# Altium schematic sheet [4]STM32F334R8T6Board_FilterAndOutputs.SchDoc
size B
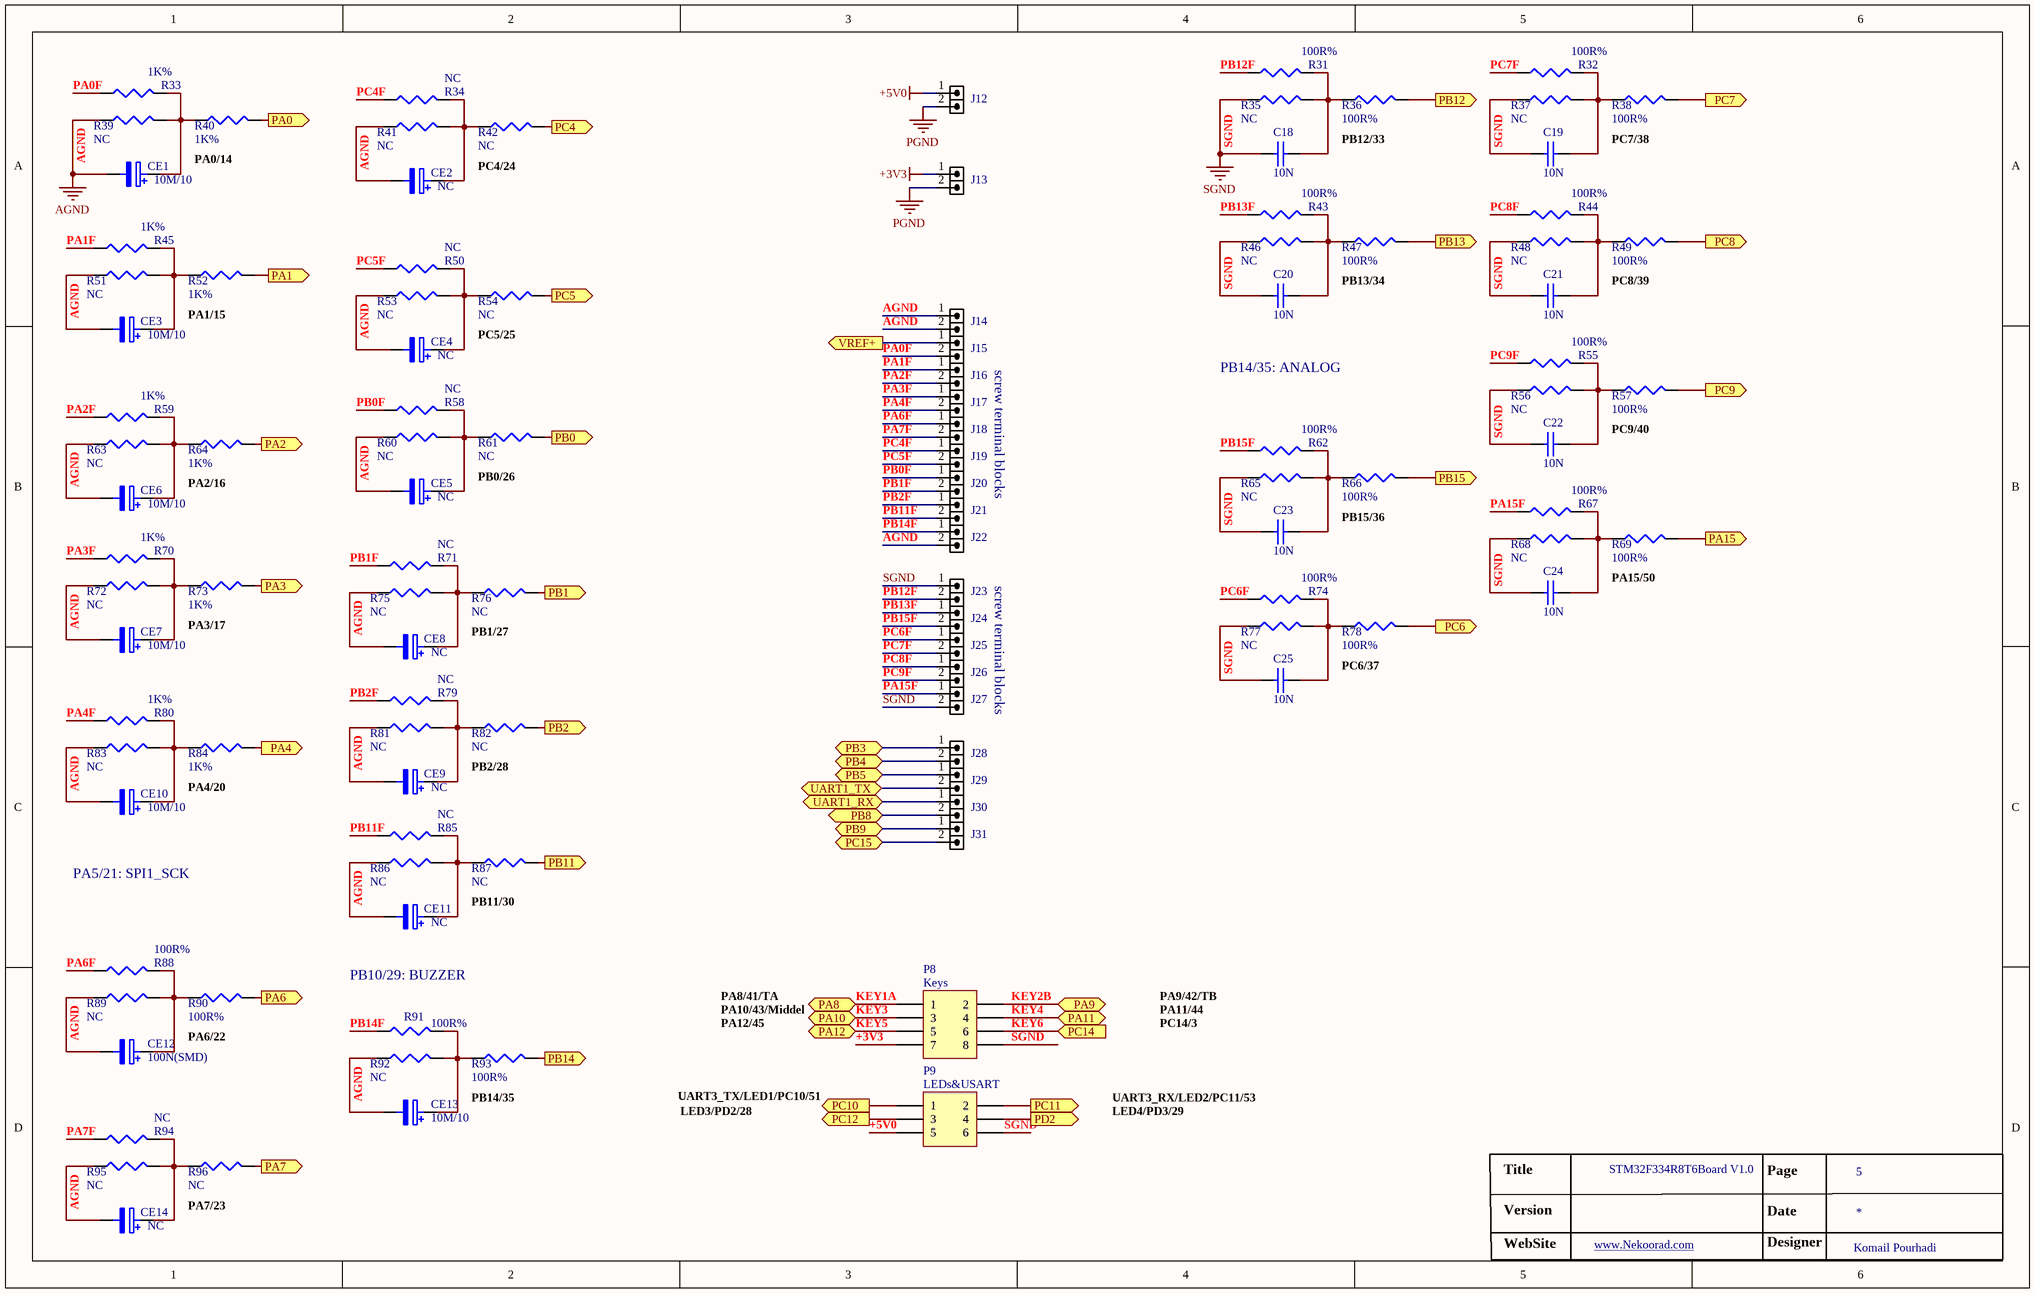
[diagram p0: [4]STM32F334R8T6Board_FilterAndOutputs.SchDoc]

## Parts
C18  10N  [SMD_CAP_1206]
C19  10N  [SMD_CAP_1206]
C20  10N  [SMD_CAP_1206]
C21  10N  [SMD_CAP_1206]
C22  10N  [SMD_CAP_1206]
C23  10N  [SMD_CAP_1206]
C24  10N  [SMD_CAP_1206]
C25  10N  [SMD_CAP_1206]
CE1  10M/10  [SMD_ECAP_D]
CE2  NC  [SMD_ECAP_D]
CE3  10M/10  [SMD_ECAP_D]
CE4  NC  [SMD_ECAP_D]
CE5  NC  [SMD_ECAP_D]
CE6  10M/10  [SMD_ECAP_D]
CE7  10M/10  [SMD_ECAP_D]
CE8  NC  [SMD_ECAP_D]
CE9  NC  [SMD_ECAP_D]
CE10  10M/10  [SMD_ECAP_D]
CE11  NC  [SMD_ECAP_D]
CE12  100N(SMD)  [SMD_ECAP_D]
CE13  10M/10  [SMD_ECAP_D]
CE14  NC  [SMD_ECAP_D]
J12  HDRM2  [header screw 2*1]  (value not drawn)
J13  HDRM2  [header screw 2*1]  (value not drawn)
J14  HDRM2  [header screw 2*1]  (value not drawn)
J15  HDRM2  [header screw 2*1]  (value not drawn)
J16  HDRM2  [header screw 2*1]  (value not drawn)
J17  HDRM2  [header screw 2*1]  (value not drawn)
J18  HDRM2  [header screw 2*1]  (value not drawn)
J19  HDRM2  [header screw 2*1]  (value not drawn)
J20  HDRM2  [header screw 2*1]  (value not drawn)
J21  HDRM2  [header screw 2*1]  (value not drawn)
J22  HDRM2  [header screw 2*1]  (value not drawn)
J23  HDRM2  [header screw 2*1]  (value not drawn)
J24  HDRM2  [header screw 2*1]  (value not drawn)
J25  HDRM2  [header screw 2*1]  (value not drawn)
J26  HDRM2  [header screw 2*1]  (value not drawn)
J27  HDRM2  [header screw 2*1]  (value not drawn)
J28  HDRM2  [header screw 2*1]  (value not drawn)
J29  HDRM2  [header screw 2*1]  (value not drawn)
J30  HDRM2  [header screw 2*1]  (value not drawn)
J31  HDRM2  [header screw 2*1]  (value not drawn)
P8  Keys  [IDC8-BOX]
P9  LEDs&USART  [IDC6-BOX]
R31  100R%  [RES_1206]
R32  100R%  [RES_1206]
R33  1K%  [RES_1206]
R34  NC  [RES_1206]
R35  NC  [RES_1206]
R36  100R%  [RES_1206]
R37  NC  [RES_1206]
R38  100R%  [RES_1206]
R39  NC  [RES_1206]
R40  1K%  [RES_1206]
R41  NC  [RES_1206]
R42  NC  [RES_1206]
R43  100R%  [RES_1206]
R44  100R%  [RES_1206]
R45  1K%  [RES_1206]
R46  NC  [RES_1206]
R47  100R%  [RES_1206]
R48  NC  [RES_1206]
R49  100R%  [RES_1206]
R50  NC  [RES_1206]
R51  NC  [RES_1206]
R52  1K%  [RES_1206]
R53  NC  [RES_1206]
R54  NC  [RES_1206]
R55  100R%  [RES_1206]
R56  NC  [RES_1206]
R57  100R%  [RES_1206]
R58  NC  [RES_1206]
R59  1K%  [RES_1206]
R60  NC  [RES_1206]
R61  NC  [RES_1206]
R62  100R%  [RES_1206]
R63  NC  [RES_1206]
R64  1K%  [RES_1206]
R65  NC  [RES_1206]
R66  100R%  [RES_1206]
R67  100R%  [RES_1206]
R68  NC  [RES_1206]
R69  100R%  [RES_1206]
R70  1K%  [RES_1206]
R71  NC  [RES_1206]
R72  NC  [RES_1206]
R73  1K%  [RES_1206]
R74  100R%  [RES_1206]
R75  NC  [RES_1206]
R76  NC  [RES_1206]
R77  NC  [RES_1206]
R78  100R%  [RES_1206]
R79  NC  [RES_1206]
R80  1K%  [RES_1206]
R81  NC  [RES_1206]
R82  NC  [RES_1206]
R83  NC  [RES_1206]
R84  1K%  [RES_1206]
R85  NC  [RES_1206]
R86  NC  [RES_1206]
R87  NC  [RES_1206]
R88  100R%  [RES_1206]
R89  NC  [RES_1206]
R90  100R%  [RES_1206]
R91  100R%  [RES_1206]
R92  NC  [RES_1206]
R93  100R%  [RES_1206]
R94  NC  [RES_1206]
R95  NC  [RES_1206]
R96  NC  [RES_1206]

## Ports
PA0 (out), PA1 (out), PA2 (out), PA3 (out), PA4 (out), PA6 (out), PA7 (out), PA8 (bidir), PA9 (bidir), PA10 (bidir), PA11 (bidir), PA12 (bidir), PA15 (out), PB0 (out), PB1 (out), PB2 (out), PB3 (bidir), PB4 (bidir), PB5 (bidir), PB8 (bidir), PB9 (bidir), PB11 (out), PB12 (out), PB13 (out), PB14 (out), PB15 (out), PC4 (out), PC5 (out), PC6 (out), PC7 (out), PC8 (out), PC9 (out), PC10 (out), PC11 (out), PC12 (out), PC14 (in), PC15 (bidir), PD2 (out), UART1_RX (bidir), UART1_TX (bidir), VREF+ (out)

## Nets
+3V3: J13.1 P8.7
+5V0: J12.1 P9.5
AGND: CE1.2 CE2.2 CE3.2 CE4.2 CE5.2 CE6.2 CE7.2 CE8.2 CE9.2 CE10.2 CE11.2 CE12.2 CE13.2 CE14.2 J14.1 J14.2 J22.2 R39.1 R41.1 R51.1 R53.1 R60.1 R63.1 R72.1 R75.1 R81.1 R83.1 R86.1 R89.1 R92.1 R95.1
PGND: J12.2 J13.2
SGND: C18.2 C19.2 C20.2 C21.2 C22.2 C23.2 C24.2 C25.2 J23.1 J27.2 P8.8 P9.6 R35.1 R37.1 R46.1 R48.1 R56.1 R65.1 R68.1 R77.1
KEY1A: P8.1 ; port PA8
KEY2B: P8.2 ; port PA9
KEY3: P8.3 ; port PA10
KEY4: P8.4 ; port PA11
KEY5: P8.5 ; port PA12
KEY6: P8.6 ; port PC14
PA0: R40.2 ; port PA0
PA0F: J15.2 R33.1
PA1: R52.2 ; port PA1
PA1F: J16.1 R45.1
PA2: R64.2 ; port PA2
PA2F: J16.2 R59.1
PA3: R73.2 ; port PA3
PA3F: J17.1 R70.1
PA4: R84.2 ; port PA4
PA4F: J17.2 R80.1
PA6: R90.2 ; port PA6
PA6F: J18.1 R88.1
PA7: R96.2 ; port PA7
PA7F: J18.2 R94.1
PA15: R69.2 ; port PA15
PA15F: J27.1 R67.1
PB0: R61.2 ; port PB0
PB0F: J20.1 R58.1
PB1: R76.2 ; port PB1
PB1F: J20.2 R71.1
PB2: R82.2 ; port PB2
PB2F: J21.1 R79.1
PB3: J28.1 ; port PB3
PB4: J28.2 ; port PB4
PB5: J29.1 ; port PB5
PB8: J30.2 ; port PB8
PB9: J31.1 ; port PB9
PB11: R87.2 ; port PB11
PB11F: J21.2 R85.1
PB12: R36.2 ; port PB12
PB12F: J23.2 R31.1
PB13: R47.2 ; port PB13
PB13F: J24.1 R43.1
PB14: R93.2 ; port PB14
PB14F: J22.1 R91.1
PB15: R66.2 ; port PB15
PB15F: J24.2 R62.1
PC4: R42.2 ; port PC4
PC4F: J19.1 R34.1
PC5: R54.2 ; port PC5
PC5F: J19.2 R50.1
PC6: R78.2 ; port PC6
PC6F: J25.1 R74.1
PC7: R38.2 ; port PC7
PC7F: J25.2 R32.1
PC8: R49.2 ; port PC8
PC8F: J26.1 R44.1
PC9: R57.2 ; port PC9
PC9F: J26.2 R55.1
PC10: P9.1 ; port PC10
PC11: P9.2 ; port PC11
PC12: P9.3 ; port PC12
PC15: J31.2 ; port PC15
PD2: P9.4 ; port PD2
UART1_RX: J30.1 ; port UART1_RX
VREF+: J15.1 ; port VREF+
NetC18_1: C18.1 R31.2 R35.2 R36.1
NetC19_1: C19.1 R32.2 R37.2 R38.1
NetC20_1: C20.1 R43.2 R46.2 R47.1
NetC21_1: C21.1 R44.2 R48.2 R49.1
NetC22_1: C22.1 R55.2 R56.2 R57.1
NetC23_1: C23.1 R62.2 R65.2 R66.1
NetC24_1: C24.1 R67.2 R68.2 R69.1
NetC25_1: C25.1 R74.2 R77.2 R78.1
NetCE1_1: CE1.1 R33.2 R39.2 R40.1
NetCE2_1: CE2.1 R34.2 R41.2 R42.1
NetCE3_1: CE3.1 R45.2 R51.2 R52.1
NetCE4_1: CE4.1 R50.2 R53.2 R54.1
NetCE5_1: CE5.1 R58.2 R60.2 R61.1
NetCE6_1: CE6.1 R59.2 R63.2 R64.1
NetCE7_1: CE7.1 R70.2 R72.2 R73.1
NetCE8_1: CE8.1 R71.2 R75.2 R76.1
NetCE9_1: CE9.1 R79.2 R81.2 R82.1
NetCE10_1: CE10.1 R80.2 R83.2 R84.1
NetCE11_1: CE11.1 R85.2 R86.2 R87.1
NetCE12_1: CE12.1 R88.2 R89.2 R90.1
NetCE13_1: CE13.1 R91.2 R92.2 R93.1
NetCE14_1: CE14.1 R94.2 R95.2 R96.1

Not connected (* = marked no-connect by the designer): J29 2

## Notes on the sheet
- PA0/14
- PB12/33
- PC7/38
- PC4/24
- PB13/34
- PC8/39
- PA1/15
- PC5/25
- screw terminal blocks
- PB14/35: ANALOG
- PC9/40
- PA2/16
- PB0/26
- PB15/36
- PA3/17
- PB1/27
- PA15/50
- PC6/37
- PB2/28
- PA4/20
- PA5/21: SPI1_SCK
- PB11/30
- PA6/22
- PB10/29: BUZZER
- PA8/41/TA
- PA10/43/Middel
- PA12/45
- PA9/42/TB
- PA11/44
- PC14/3
- PB14/35
- UART3_TX/LED1/PC10/51
- UART3_RX/LED2/PC11/53
- LED3/PD2/28
- LED4/PD3/29
- Title
- STM32F334R8T6Board V1.0
- Page
- 5
- PA7/23
- Version
- WebSite
- www.Nekoorad.com <http://www.Nekoorad.com>
- Date
- Designer
- Komail Pourhadi

## Library data of the parts
C18-C25 = C
CE1-CE14 = E
J12-J31 = HDR_M_1X2: CONN, HEADER, Male, pitch: 2.54mm, 2POS; VALUE: HDRM2
P8 = Header 4X2: Header, 4-Pin, Dual row; LatestRevisionDate: 17-Jul-2002; LatestRevisionNote: Re-released for DXP Platform.; Publisher: Altium Limited
P9 = Header 3X2: Header, 3-Pin, Dual row; LatestRevisionDate: 17-Jul-2002; LatestRevisionNote: Re-released for DXP Platform.; Publisher: Altium Limited
R31-R96 = R